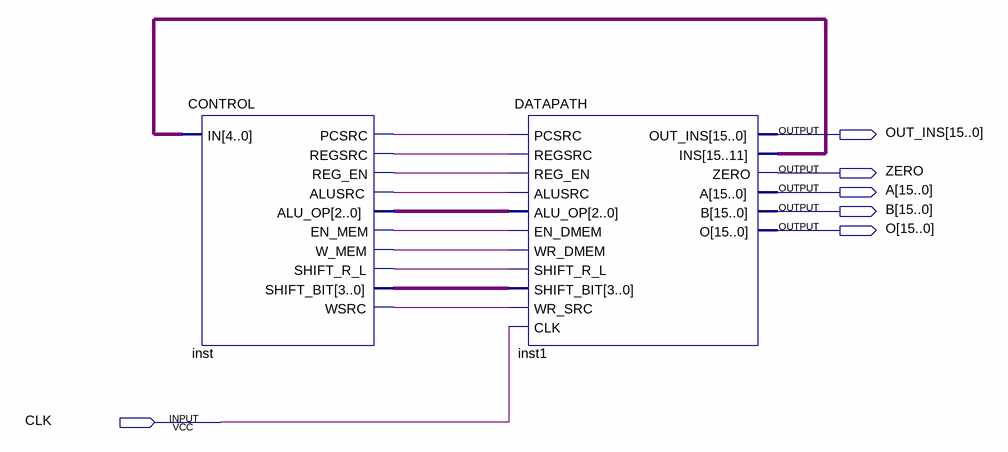
[diagram p0: schematic sheet]
// Quartus schematic RISC.bdf as structural Verilog: 2 symbols, 6 pins
module RISC (
  input  CLK,
  output [15:0] OUT_INS,
  output ZERO,
  output [15:0] A,
  output [15:0] B,
  output [15:0] O
);

  wire inst_alusrc, inst_en_mem, inst_pcsrc, inst_reg_en, inst_regsrc, inst_shift_r_l, inst_w_mem, inst_wsrc;
  wire [2:0] inst_alu_op;
  wire [3:0] inst_shift_bit;
  wire [4:0] inst1_ins;

  CONTROL inst (
    .IN(inst1_ins), .PCSRC(inst_pcsrc), .REGSRC(inst_regsrc), .REG_EN(inst_reg_en), .ALUSRC(inst_alusrc),
    .ALU_OP(inst_alu_op), .EN_MEM(inst_en_mem), .W_MEM(inst_w_mem), .SHIFT_R_L(inst_shift_r_l),
    .SHIFT_BIT(inst_shift_bit), .WSRC(inst_wsrc));
  DATAPATH inst1 (
    .PCSRC(inst_pcsrc), .REGSRC(inst_regsrc), .REG_EN(inst_reg_en), .ALUSRC(inst_alusrc),
    .ALU_OP(inst_alu_op), .EN_DMEM(inst_en_mem), .WR_DMEM(inst_w_mem), .SHIFT_R_L(inst_shift_r_l),
    .SHIFT_BIT(inst_shift_bit), .WR_SRC(inst_wsrc), .CLK(CLK), .OUT_INS(OUT_INS), .INS(inst1_ins),
    .ZERO(ZERO), .A(A), .B(B), .O(O));
endmodule
